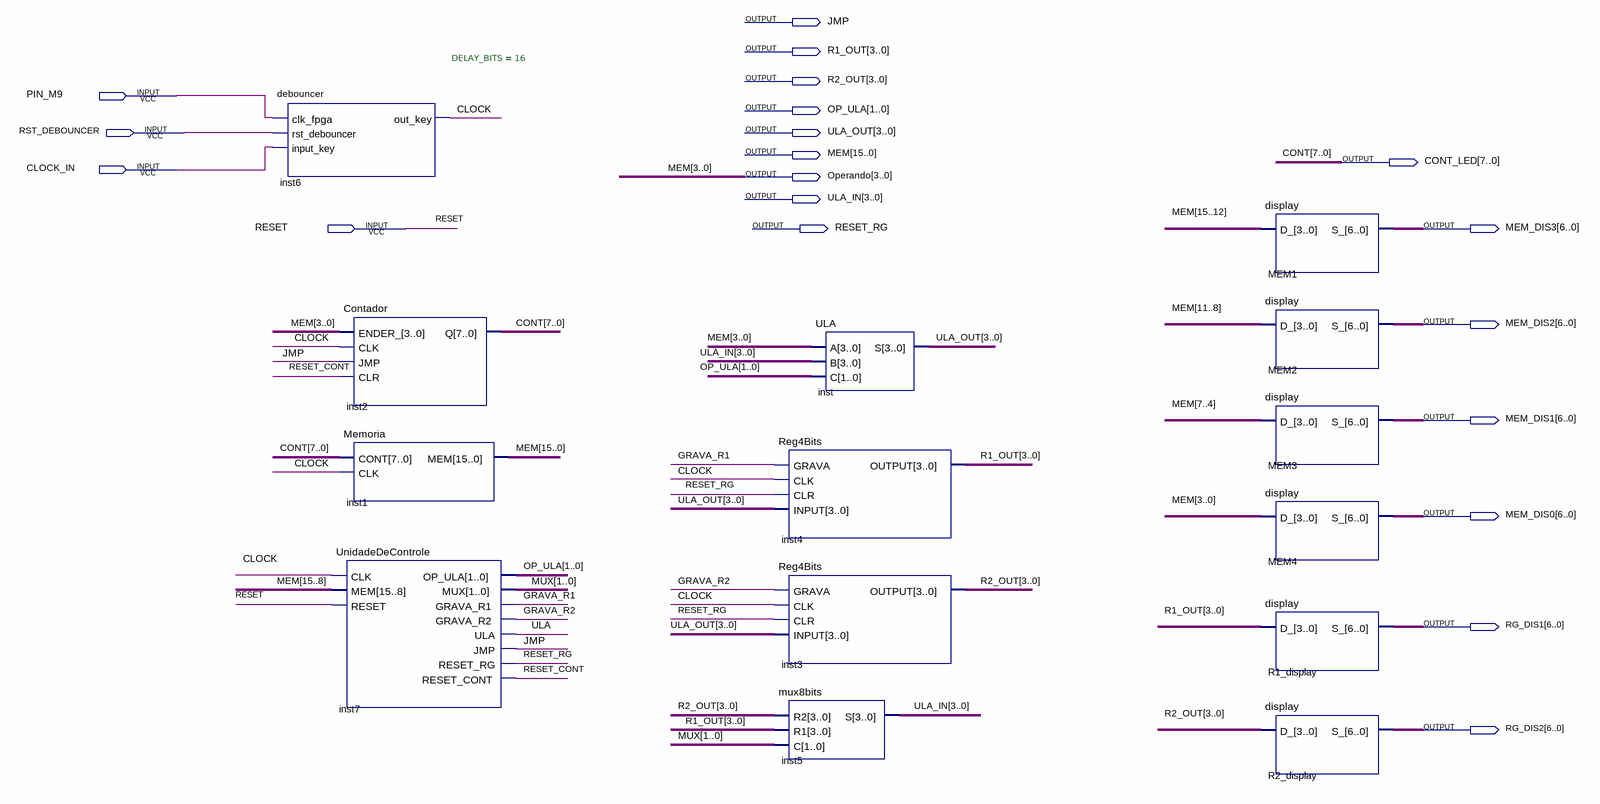
[diagram p0: schematic sheet]
// Quartus schematic CPU.bdf as structural Verilog: 14 symbols, 20 pins
module CPU (
  input  PIN_M9,
  input  RST_DEBOUNCER,
  input  CLOCK_IN,
  input  RESET,
  output JMP,
  output [3:0] R1_OUT,
  output [3:0] R2_OUT,
  output [1:0] OP_ULA,
  output [3:0] ULA_OUT,
  output [15:0] MEM,
  output [7:0] CONT_LED,
  output [3:0] Operando,
  output [3:0] ULA_IN,
  output RESET_RG,
  output [6:0] MEM_DIS3,
  output [6:0] MEM_DIS2,
  output [6:0] MEM_DIS1,
  output [6:0] MEM_DIS0,
  output [6:0] RG_DIS1,
  output [6:0] RG_DIS2
);

  wire CLOCK, GRAVA_R1, GRAVA_R2, RESET_CONT, ULA;
  wire [1:0] MUX;

  debouncer #(.DELAY_BITS(16)) inst6 (
    .clk_fpga(PIN_M9), .rst_debouncer(RST_DEBOUNCER), .input_key(CLOCK_IN), .out_key(CLOCK));
  Contador inst2 (.ENDER_(MEM[3:0]), .CLK(CLOCK), .JMP(JMP), .CLR(RESET_CONT), .Q(CONT_LED));
  Memoria inst1 (.CONT(CONT_LED), .CLK(CLOCK), .MEM(MEM));
  UnidadeDeControle inst7 (
    .CLK(CLOCK), .MEM(MEM[15:8]), .RESET(RESET), .OP_ULA(OP_ULA), .MUX(MUX), .GRAVA_R1(GRAVA_R1),
    .GRAVA_R2(GRAVA_R2), .ULA(ULA), .JMP(JMP), .RESET_RG(RESET_RG), .RESET_CONT(RESET_CONT));
  Reg4Bits inst4 (.GRAVA(GRAVA_R1), .CLK(CLOCK), .CLR(RESET_RG), .INPUT(ULA_OUT), .OUTPUT(R1_OUT));
  Reg4Bits inst3 (.GRAVA(GRAVA_R2), .CLK(CLOCK), .CLR(RESET_RG), .INPUT(ULA_OUT), .OUTPUT(R2_OUT));
  mux8bits inst5 (.R2(R2_OUT), .R1(R1_OUT), .C(MUX), .S(ULA_IN));
  ULA inst (.A(MEM[3:0]), .B(ULA_IN), .C(OP_ULA), .S(ULA_OUT));
  display MEM1 (.D_(MEM[15:12]), .S_(MEM_DIS3));
  display MEM2 (.D_(MEM[11:8]), .S_(MEM_DIS2));
  display MEM3 (.D_(MEM[7:4]), .S_(MEM_DIS1));
  display MEM4 (.D_(MEM[3:0]), .S_(MEM_DIS0));
  display R1_display (.D_(R1_OUT), .S_(RG_DIS1));
  display R2_display (.D_(R2_OUT), .S_(RG_DIS2));

  assign Operando = MEM[3:0];

  // Other names for the same wires on the sheet: CONT[7:0] = CONT_LED
endmodule
